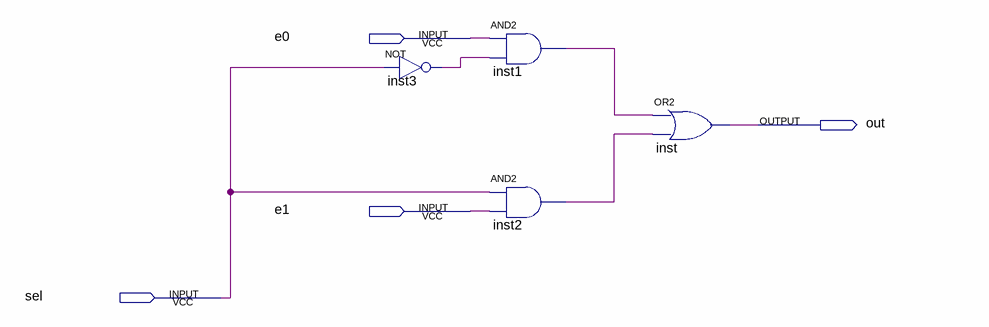
[diagram p0: schematic sheet]
// Quartus schematic pfs_mux2x1.bdf as structural Verilog: 4 symbols, 4 pins
module pfs_mux2x1 (
  input  e0,
  input  e1,
  input  sel,
  output out
);

  wire inst1_out, inst2_out, inst3_out;

  not inst3 (inst3_out, sel);
  and inst1 (inst1_out, e0, inst3_out);
  and inst2 (inst2_out, sel, e1);
  or inst (out, inst1_out, inst2_out);
endmodule
